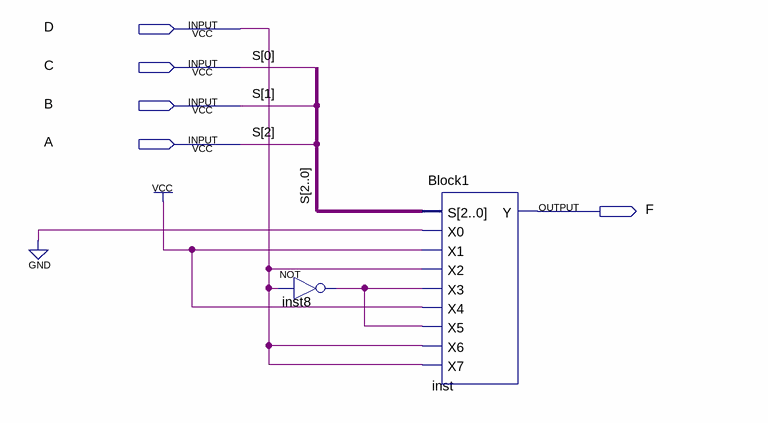
[diagram p0: schematic sheet]
// Quartus schematic Block2.bdf as structural Verilog: 2 symbols, 5 pins
module Block2 (
  input  D,
  input  C,
  input  B,
  input  A,
  output F
);

  wire inst8_out;

  not inst8 (inst8_out, D);
  Block1 inst (
    .S({A, B, C}), .X0(1'b0), .X1(1'b1), .X2(D), .X3(inst8_out), .X4(1'b1), .X5(inst8_out), .X6(D), .X7(D),
    .Y(F));

  // Other names for the same wires on the sheet: S[2:0] = {A, B, C}
endmodule
